# EAGLE board KMO_IO_MV2_5 (EAGLE 9.4.2)
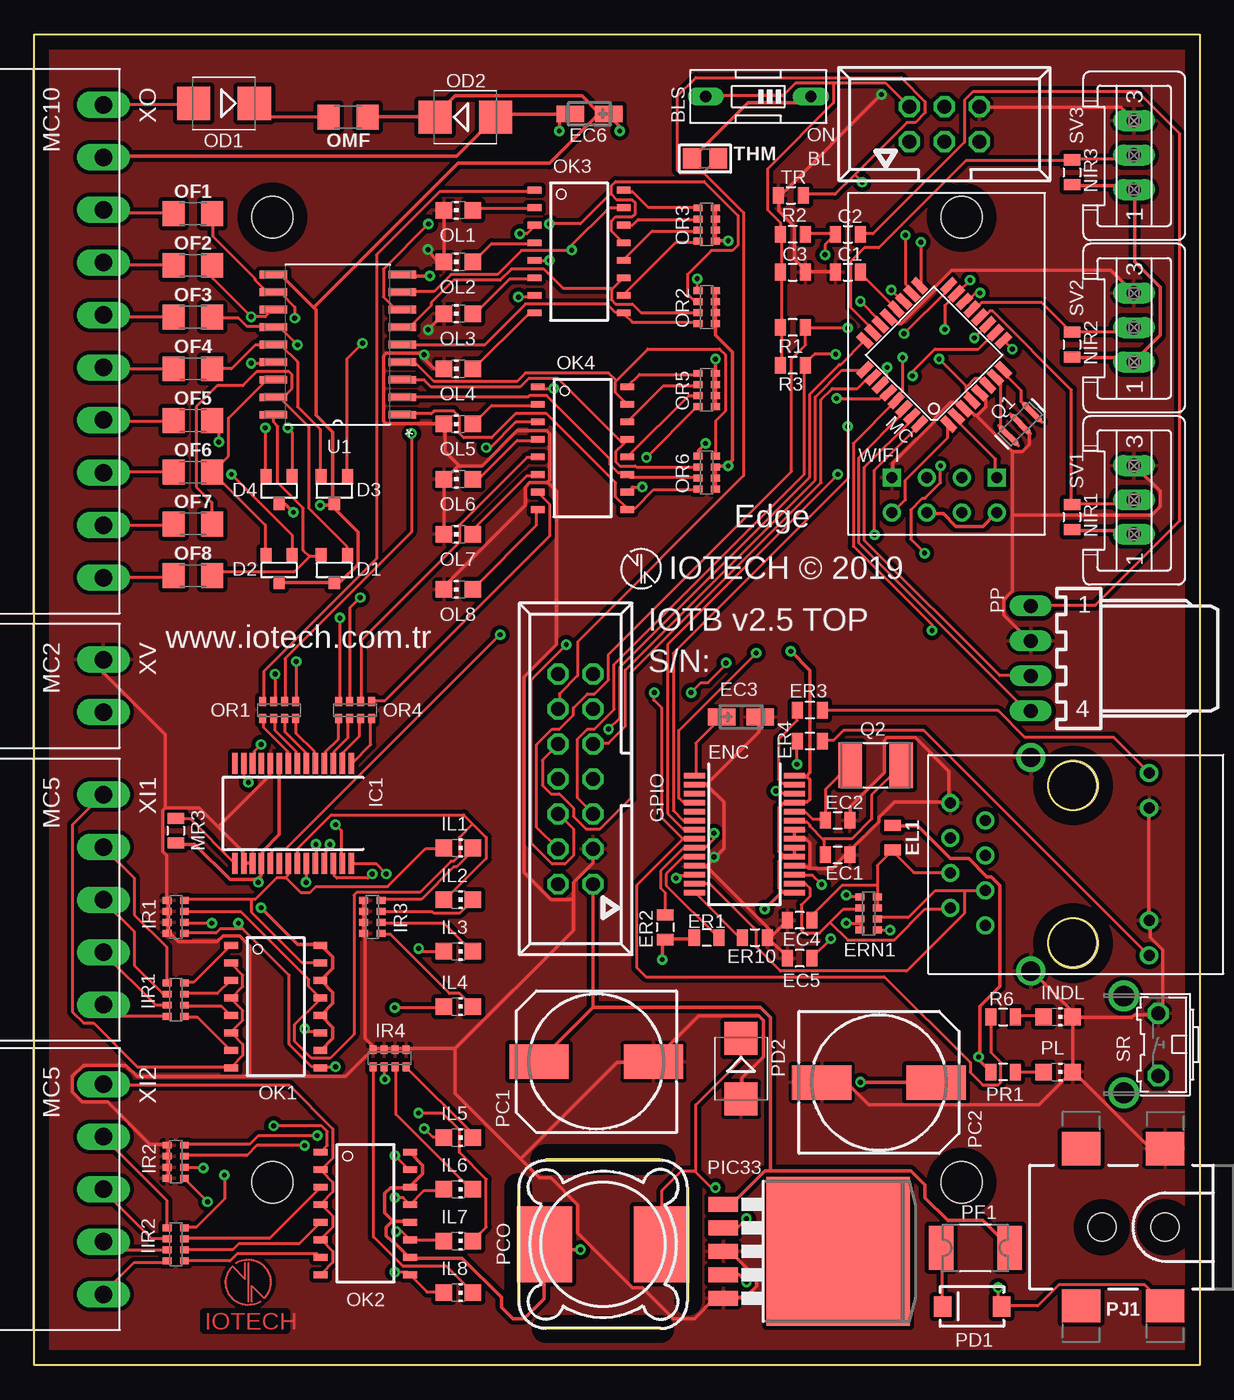
[diagram p2: board, top side]
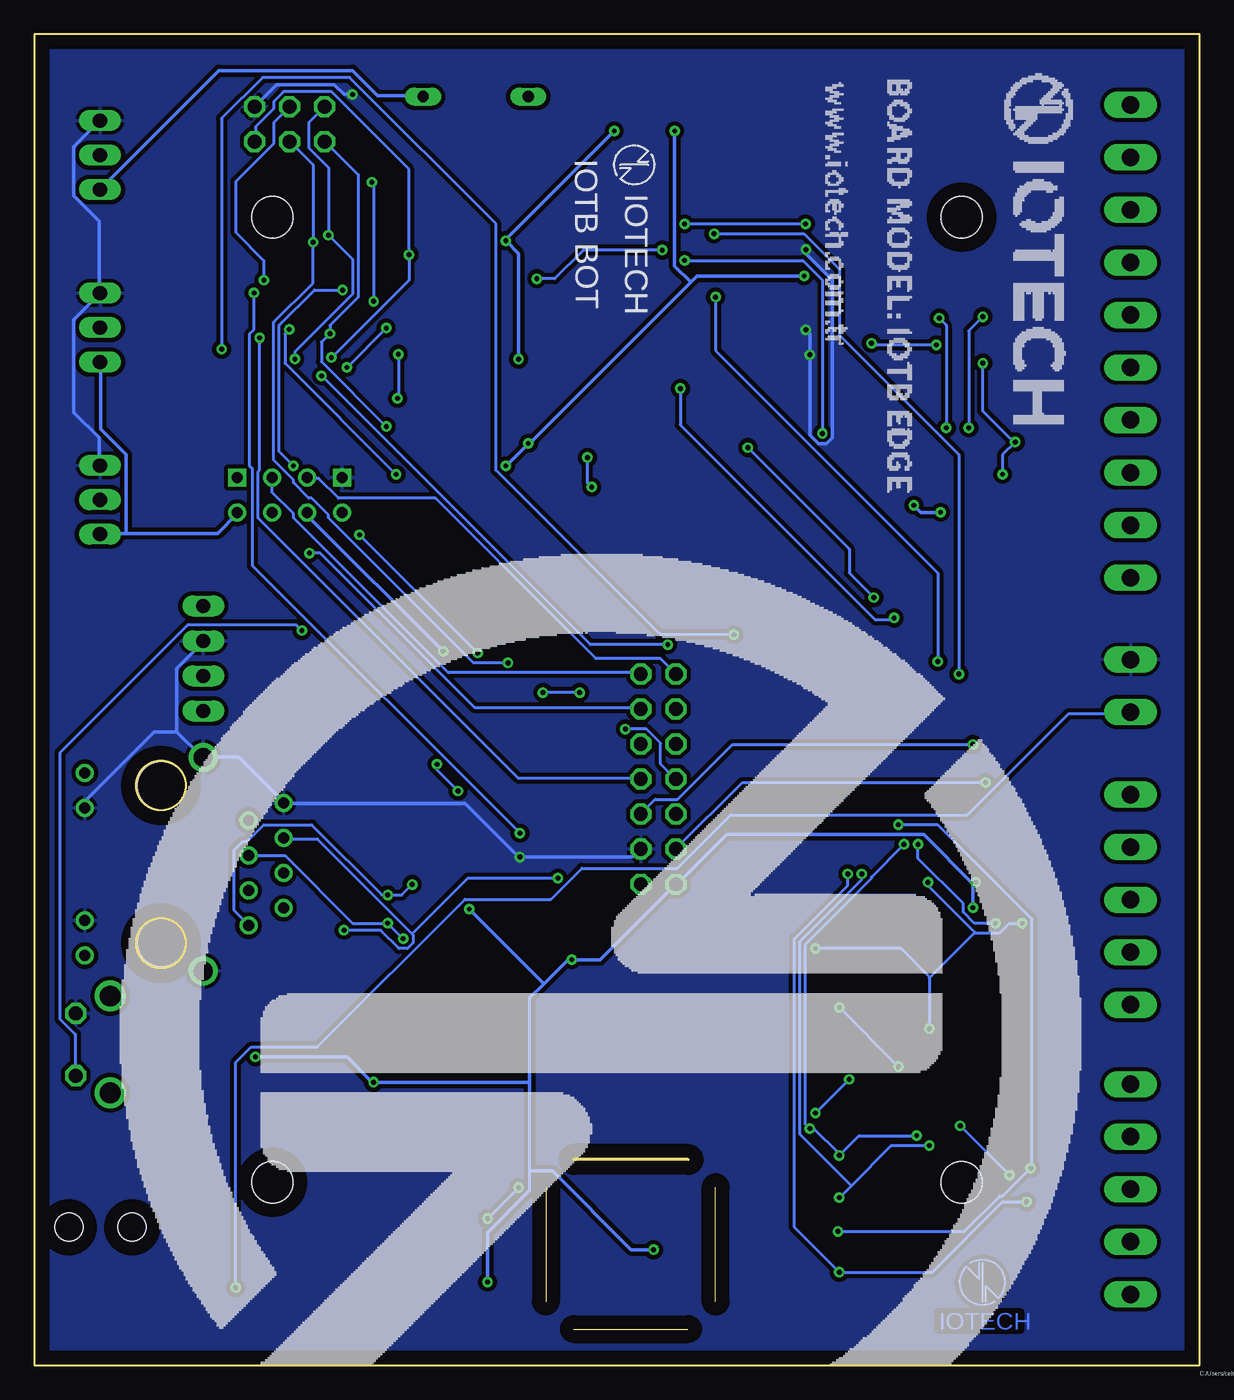
[diagram p3: board, bottom side, seen from below]

Size 84.5 x 96.5 mm. Coordinates in mm from the lower left corner, seen from the top.
Outline: 0,0 0,96.5 84.5,96.5 84.5,0 0,0
Copper layers (1*16): Top 0.035mm / dielectric 1.5mm / Bottom 0.035mm
Design rules "KMO_IO_M": minimum track width 6mil, minimum drill 0.35mm, track to track 0.205mm, track to pad 0.205mm, pad to pad 0.205mm, via to via 0.205mm, smd to smd 6mil, copper to edge 40mil, drill to drill 6mil, minimum pad ring 10mil, minimum via ring 8mil, stop-mask expansion 4mil, vias tented up to drill 0mil, thermal gap 10mil
Net classes: 0 default: width 0.203 mm, drill 0.3 mm, clearance 0.16 mm; 1 vcc: width 0.254 mm, drill 0.3 mm, clearance 0.16 mm; 2 3.3 power line: width 0.254 mm, drill 0.3 mm, clearance 0.16 mm; 3 outsise power line: width 0.254 mm, drill 0.3 mm, clearance 0.16 mm
Holes 3 mm at 17.25,83.25 67.25,83.25 17.25,13.25 67.25,13.25

## Footprints (pad centres in the part's own frame; a part is rotated, then mirrored left to right if it is on the bottom)
057-006-1 = drill 1 octagon: 1 -2.54,-1.27; 2 -2.54,1.27; 3 0,-1.27; 4 0,1.27; 5 2.54,-1.27; 6 2.54,1.27
EDG-01 = drill 0.813 long: 1 0,-3.81; 2 0,3.81
0805 = smd 0.8 x 1.2: 1 -0.9,0; 2 0.9,0
SOT-23-3 = smd 0.802 x 0.972: 1 -0.95,-1; 2 0.95,-1; 3 0,1
CT3216 = smd 2 x 1.2: + -1.4,0; - 1.4,0
SSOP28 = smd 0.4 x 1.5: 1 -4.225,-3.625; 2 -3.575,-3.625; 3 -2.925,-3.625; 4 -2.275,-3.625; 5 -1.625,-3.625; 6 -0.975,-3.625; 7 -0.325,-3.625; 8 0.325,-3.625; 9 0.975,-3.625; 10 1.625,-3.625; 11 2.275,-3.625; 12 2.925,-3.625; 13 3.575,-3.625; 14 4.225,-3.625; 15 4.225,3.625; 16 3.575,3.625; 17 2.925,3.625; 18 2.275,3.625; 19 1.625,3.625; 20 0.975,3.625; 21 0.325,3.625; 22 -0.325,3.625; 23 -0.975,3.625; 24 -1.625,3.625; 25 -2.275,3.625; 26 -2.925,3.625; 27 -3.575,3.625; 28 -4.225,3.625
0603-ARV = smd 0.5 x 0.65: 1 -1.2,-0.625; 2 -0.4,-0.625; 3 0.4,-0.625; 4 1.2,-0.625; 5 1.2,0.625; 6 0.4,0.625; 7 -0.4,0.625; 8 -1.2,0.625
057-014-1 = drill 1 octagon: 1 -7.62,-1.27; 2 -7.62,1.27; 3 -5.08,-1.27; 4 -5.08,1.27; 5 -2.54,-1.27; 6 -2.54,1.27; 7 0,-1.27; 8 0,1.27; 9 2.54,-1.27; 10 2.54,1.27; 11 5.08,-1.27; 12 5.08,1.27; 13 7.62,-1.27; 14 7.62,1.27
CHIP-LED0805 = smd 1.2 x 1.2: A 0,-1.05; C 0,1.05
TQFP32-08 = smd 1.27 x 0.559: 1 -4.293,2.8; 2 -4.293,2; 3 -4.293,1.2; 4 -4.293,0.4; 5 -4.293,-0.4; 6 -4.293,-1.2; 7 -4.293,-2; 8 -4.293,-2.8; 17 4.293,-2.8; 18 4.293,-2; 19 4.293,-1.2; 20 4.293,-0.4; 21 4.293,0.4; 22 4.293,1.2; 23 4.293,2; 24 4.293,2.8 | smd 0.559 x 1.27: 9 -2.8,-4.293; 10 -2,-4.293; 11 -1.2,-4.293; 12 -0.4,-4.293; 13 0.4,-4.293; 14 1.2,-4.293; 15 2,-4.293; 16 2.8,-4.293; 25 2.8,4.293; 26 2,4.293; 27 1.2,4.293; 28 0.4,4.293; 29 -0.4,4.293; 30 -1.2,4.293; 31 -2,4.293; 32 -2.8,4.293
SMB = smd 2.4 x 2.4: A 2.2,0; C -2.2,0
1206 = smd 1.6 x 1.8: 1 -1.4,0; 2 1.4,0
MINI-FLAT-16 = smd 1 x 0.5: 1 -3.24,4.445; 2 -3.24,3.175; 3 -3.24,1.905; 4 -3.24,0.635; 5 -3.24,-0.635; 6 -3.24,-1.905; 7 -3.24,-3.175; 8 -3.24,-4.445; 9 3.24,-4.445; 10 3.24,-3.175; 11 3.24,-1.905; 12 3.24,-0.635; 13 3.24,0.635; 14 3.24,1.905; 15 3.24,3.175; 16 3.24,4.445
140CLH-1010 = smd 4.3 x 2.5: + 4.15,0; - -4.15,0
MSS1260 = smd 5.5 x 4: P$1 0,4.25; P$2 0,-4.25
SMA-DIODE = smd 1.27 x 1.47: A -2.15,0; C 2.15,0
1820 = smd 1.78 x 3.2: 1 -2.49,0; 2 2.49,0
TO263-5 = smd 1.067 x 2.159: 1 -3.404,-5.791; 2 -1.702,-5.791; 3 0,-5.791; 4 1.702,-5.791; 5 3.404,-5.791 | smd 10.8 x 10.41: 6 0,2.54
POWER_JACK_SMD_OVERPASTE_TOE = smd 2.8 x 2.4: GND 0,-5.7; P$4 6.1,-5.7; VIN0 0,5.7; VIN1 6.1,5.7 | hole 2.032: 0,0; 4.572,0
7395-04 = drill 1.016 long: 1 3.81,0; 2 1.27,0; 3 -1.27,0; 4 -3.81,0
RESONATOR-SMD-1:1 = smd 0.45 x 1.905: 1 -1.2,0; 2 0,0; 3 1.2,0
5.0X3.2_2 = smd 1.7 x 3.3: 1 -1.85,0; 2 1.85,0
B3F-31XX = drill 1.016 octagon: 1 -2.261,-1.245; 2 2.261,-1.245 | drill 1.499 pad 2.159: 3 -3.505,1.245; 4 3.505,1.245
S03P = drill 1.016 long: 1 2.5,0; 2 0,0; 3 -2.5,0
MICROBUILDER_0805_NOTHERMALS = smd 1.3 x 1.5: 1 -0.95,0; 2 0.95,0
SOIC127P1030X265-18N = smd 1.981 x 0.559: 1 -4.674,5.08; 2 -4.674,3.81; 3 -4.674,2.54; 4 -4.674,1.27; 5 -4.674,0; 6 -4.674,-1.27; 7 -4.674,-2.54; 8 -4.674,-3.81; 9 -4.674,-5.08; 10 4.674,-5.08; 11 4.674,-3.81; 12 4.674,-2.54; 13 4.674,-1.27; 14 4.674,0; 15 4.674,1.27; 16 4.674,2.54; 17 4.674,3.81; 18 4.674,5.08
RJ45 = drill 0.8: G+ 5.84,-6.305; G- 5.84,-3.765; GND -8.57,4.76; NC -6.03,3.5; P4 -8.57,-0.32; P5 -6.03,0.96; RD+ -6.03,-1.58; RD- -8.57,2.22; TD+ -6.03,-4.12; TD- -8.57,-2.86; Y+ 5.84,6.945; Y- 5.84,4.405 | drill 1.4: SHIELD1 -2.73,-7.425; SHIELD2 -2.73,8.065 | hole 3.5: 0.3,-5.38; 0.3,6.02
ESP01 = drill 0.8: CH_PD -1.285,-8.178; GPIO0 1.255,-5.638; GPIO2 -1.285,-5.638; RST 1.255,-8.178; TX -3.825,-8.178; VCC 3.795,-8.178 | drill 0.8 square: GND -3.825,-5.638; RX 3.795,-5.638
MC5 = drill 1.27 long: 1 -7.62,0; 2 -3.81,0; 3 0,0; 4 3.81,0; 5 7.62,0
MC10 = drill 1.27 long: 1 -17.145,0; 2 -13.335,0; 3 -9.525,0; 4 -5.715,0; 5 -1.905,0; 6 1.905,0; 7 5.715,0; 8 9.525,0; 9 13.335,0; 10 17.145,0
MC2 = drill 1.27 long: 1 -1.905,0; 2 1.905,0

## Placement (x,y rotation side)
BL  057-006-1  [057-006-1]  66,90 0 top
BLS  ON  [EDG-01]  52.5,92 90 top
C1  100nF  [0805]  59,79.26 0 top
C2  100nF  [0805]  59,82.01 0 top
C3  100nF  [0805]  55,79.26 0 top
D1  BAV70  [SOT-23-3]  21.75,57.75 180 top
D2  BAV70  [SOT-23-3]  17.75,57.75 180 top
D3  BAV70  [SOT-23-3]  21.75,63.5 180 top
D4  BAV70  [SOT-23-3]  17.75,63.5 180 top
EC1  18p  [0805]  58.25,37 0 top
EC2  18p  [0805]  58.25,39.5 0 top
EC3  10u  [CT3216]  51.25,47 0 top
EC4  10n  [0805]  55.5,32.25 180 top
EC5  10n  [0805]  55.5,29.5 180 top
EC6  10u  [CT3216]  40.25,90.75 180 top
EL1  10µH  [0805]  62.25,38.25 270 top
ENC  ENC28J60-SSOP  [SSOP28]  51.5,38.5 270 top
ER1  10k  [0805]  48.75,31 180 top
ER2  10k  [0805]  45.75,31.75 270 top
ER3  1k  [0805]  56.25,47.5 180 top
ER4  1k  [0805]  56.25,45.25 180 top
ER10  2.7K  [0805]  52.25,31 0 top
ERN1  49.9R  [0603-ARV]  60.5,32.75 270 top
GPIO  057-014-1  [057-014-1]  39.25,42.5 90 top
IC1  MCP23017SS  [SSOP28]  18.75,40 180 top
IIR1  6.8K  [0603-ARV]  10.25,26.5 270 top
IIR2  6.8K  [0603-ARV]  10.25,8.75 270 top
IL1  BLU  [CHIP-LED0805]  30.75,37.5 270 top
IL2  BLU  [CHIP-LED0805]  30.75,33.75 270 top
IL3  BLU  [CHIP-LED0805]  30.75,30 270 top
IL4  BLU  [CHIP-LED0805]  30.75,26 270 top
IL5  BLU  [CHIP-LED0805]  30.75,16.5 270 top
IL6  BLU  [CHIP-LED0805]  30.75,12.75 270 top
IL7  BLU  [CHIP-LED0805]  30.75,9 270 top
IL8  BLU  [CHIP-LED0805]  30.75,5.25 270 top
INDL  BLU  [CHIP-LED0805]  74.25,25.25 270 top
IR1  10K  [0603-ARV]  10.25,32.5 90 top
IR2  10K  [0603-ARV]  10.25,14.75 90 top
IR3  1K  [0603-ARV]  24.5,32.5 270 top
IR4  1K  [0603-ARV]  25.75,22.25 180 top
MC  ATMEGA328  [TQFP32-08]  65.25,73.26 135 top
MR3  10K  [0805]  10.25,38.75 270 top
NIR1  4700  [0805]  75.25,61.5 270 top
NIR2  4700  [0805]  75.25,74 270 top
NIR3  4700  [0805]  75.25,86.5 270 top
OD1  SS54  [SMB]  13.75,91.5 180 top
OD2  28V  [SMB]  31.25,90.5 0 top
OF1  100mA  [1206]  11.5,83.5 0 top
OF2  100mA  [1206]  11.5,79.75 0 top
OF3  100mA  [1206]  11.5,76 0 top
OF4  100mA  [1206]  11.5,72.25 0 top
OF5  100mA  [1206]  11.5,68.5 0 top
OF6  100mA  [1206]  11.5,64.75 0 top
OF7  100mA  [1206]  11.5,61 0 top
OF8  100mA  [1206]  11.5,57.25 0 top
OK1  TLP283-4  [MINI-FLAT-16]  17.5,26 0 top
OK2  TLP283-4  [MINI-FLAT-16]  24,11 0 top
OK3  TLP283-4  [MINI-FLAT-16]  39.5,80.75 0 top
OK4  TLP283-4  [MINI-FLAT-16]  39.75,66.5 0 top
OL1  BLU  [CHIP-LED0805]  30.75,83.75 90 top
OL2  BLU  [CHIP-LED0805]  30.75,80 90 top
OL3  BLU  [CHIP-LED0805]  30.75,76.25 90 top
OL4  BLU  [CHIP-LED0805]  30.75,72.25 90 top
OL5  BLU  [CHIP-LED0805]  30.75,68.25 90 top
OL6  BLU  [CHIP-LED0805]  30.75,64.25 90 top
OL7  BLU  [CHIP-LED0805]  30.75,60.25 90 top
OL8  BLU  [CHIP-LED0805]  30.75,56.25 90 top
OMF  750mA  [1206]  22.75,90.5 180 top
OR1  1K  [0603-ARV]  17.75,47.5 180 top
OR2  10K  [0603-ARV]  48.75,76.72 270 top
OR3  10K  [0603-ARV]  48.75,82.72 270 top
OR4  1K  [0603-ARV]  23.25,47.5 180 top
OR5  10K  [0603-ARV]  48.75,70.72 270 top
OR6  10K  [0603-ARV]  48.75,64.72 270 top
PC1  220uf 50v  [140CLH-1010]  40.75,22 180 top
PC2  220uf 50v  [140CLH-1010]  61.25,20.5 0 top
PCO  220 uh  [MSS1260]  41.25,8.75 90 top
PD1  M7  [SMA-DIODE]  68,4.25 180 top
PD2  SS54  [SMB]  51.25,21.5 270 top
PF1  1A  [1820]  68.25,8.5 0 top
PIC33  LM2596S-3.3  [TO263-5]  55.75,8.25 270 top
PJ1  POWER_JACKTOE  [POWER_JACK_SMD_OVERPASTE_TOE]  82,10 180 top
PL  GRN  [CHIP-LED0805]  74.25,21.25 270 top
PP  22-05-7048-04  [7395-04]  72.25,51.25 90 top
PR1  1k  [0805]  70.25,21.25 180 top
Q1  8MHz  [RESONATOR-SMD-1:1]  71.5,68.26 45 top
Q2  25MHz  [5.0X3.2_2]  61,43.5 0 top
R1  1.5K  [0805]  55,75.25 180 top
R2  10K  [0805]  55,82.01 180 top
R3  1.5K  [0805]  55,72.5 180 top
R6  1k  [0805]  70.25,25.25 0 top
SR  gnd  [B3F-31XX]  80.25,23.25 90 top
SV1  3.3V  [S03P]  79.75,62.75 270 top
SV2  3.3V  [S03P]  79.75,75.25 270 top
SV3  3.3V  [S03P]  79.75,87.75 270 top
THM  THERM  [MICROBUILDER_0805_NOTHERMALS]  48.64,87.5 0 top
TR  10K  [0805]  54.86,84.84 0 top
U1  ULN2803ADW  [SOIC127P1030X265-18N]  22,74 180 top
U$1  [IOTECH_COPPER_W_TEXT]  15.5,6 0 top
U$2  HR911105A  [RJ45]  75,36 0 top
U$4  [IOTECH_COPPER_W_TEXT]  15.75,6 0 bottom
WIFI  ESP01  [ESP01]  66,70 0 top
XI1  MC5  [MC5]  5,33.75 270 top
XI2  MC5  [MC5]  5,12.75 270 top
XO  MC10  [MC10]  5,74.25 270 top
XV  MC2  [MC2]  5,49.25 270 top

## Tracks (layer width: path | path; a pad name or v marks a point on that pad's centre or on a via)
+3V3  (via drill 0.35)
  Top 0.254: THM.1 47.76,87.56 51.74,91.54 55.82,91.54 56.23,91.95 BLS.1 | NIR3.2 75.31,85.52 79.5,85.52 79.7,85.31 SV3.1 79.8,85.21 79.8,80.01 81.64,78.17 81.64,74.7 79.8,72.86 SV2.1 79.7,72.76 79.39,73.07 75.31,73.07 NIR2.2 | NIR1.2 75.31,60.52 79.5,60.52 79.7,60.31 SV1.1 | WIFI.CH_PD 64.8,61.74 65.92,61.74 66.84,60.82 68.78,60.82 69.7,61.74 WIFI.VCC | OK1.10 20.82,22.86 21.64,23.68 21.64,24.49 20.82,25.31 OK1.12 20.82,25.41 21.64,26.23 21.64,27.04 20.82,27.86 OK1.14 20.82,27.96 21.64,28.78 21.64,29.59 20.82,30.41 OK1.16 20.72,30.51 19.08,30.51 v16.43,33.17 | 16.12,35.21 14.19,35.21 11.63,37.76 10.31,37.76 MR3.2 | 16.12,35.21 16.43,35.51 16.43,36.33 IC1.18 16.53,36.43 16.53,37.25 17.76,38.47 17.76,43.58 IC1.9 | v16.23,35 16.12,35.1 16.12,35.21 | OK2.16 27.25,15.41 28.17,14.49 28.17,13.88 27.25,12.96 OK2.14 27.14,12.86 25.82,12.86 25.41,12.45 25.41,11.02 25.92,10.51 25.92,10.41 | 25.92,10.41 25.51,10 25.51,9.39 25.92,8.98 26.02,8.98 27.14,7.86 OK2.10 27.35,7.76 31.02,7.76 33.88,4.9 33.88,4.18 34.7,3.37 35.51,3.37 36.94,4.8 36.94,8.67 PCO.P$1 37.04,8.37 v39.59,8.37 | 25.92,10.41 27.14,10.41 OK2.12 | 68.58,22.35 68.58,22.04 69.29,21.33 PR1.2 | 68.58,22.35 68.58,26.02 70.01,27.45 70.01,34.8 69.39,35.41 69.09,35.41 67.76,36.74 66.44,36.74 64.09,39.09 62.25,39.09 EL1.1 | 54.29,34.29 55.11,34.29 ENC.15 | 54.29,34.29 53.98,34.59 53.98,36.53 54.29,36.84 | 54.29,36.84 55.11,36.84 ENC.19 55.11,36.94 55.11,37.45 ENC.20 | 54.29,36.84 54.29,36.94 53.98,37.25 53.98,40.41 54.29,40.72 55.11,40.72 ENC.25 55.21,40.82 56.02,40.82 56.23,41.02 56.23,42.45 56.02,42.66 55.21,42.66 ENC.28 56.01,42.73 56.26,42.97 56.26,50.37 v54.86,51.77
  Top 0.254: ER1.2 47.76,30.92 45.82,30.92 ER2.2 45.53,30.64 v45.53,29.4 | v51.64,6.02 51.13,6.53 50.01,6.53 PIC33.4 | v59.9,20.51 65.31,20.51 PC2.+ | v52.96,33.06 54.19,34.29 54.29,34.29 | v68.48,22.35 68.58,22.35
  Bottom 0.254: 77.86,60.31 71.23,60.31 69.8,61.74 WIFI.VCC | 77.86,60.31 79.7,60.31 SV1.1 | 77.86,60.31 77.86,66.03 79.7,67.86 79.7,72.66 SV2.1 | BLS.1 56.33,92.05 59.6,92.05 61.43,93.89 71.13,93.89 79.7,85.31 SV3.1 | v16.43,33.17 16.43,34.8 v16.23,35 16.43,34.9 20,38.47 34.29,38.47 37.86,34.9 GPIO.2 38.06,34.8 43.47,29.4 v45.53,29.4 45.81,29.4 47.55,27.66 | v51.64,6.02 51.64,9.59 48.58,12.65 48.58,14.08 | 48.58,20.51 48.58,26.64 47.55,27.66 | 48.58,20.51 48.58,14.08 | 48.58,20.51 v59.9,20.51 60.01,20.51 61.84,22.35 v68.48,22.35 | 47.55,27.66 v52.96,33.06 | v39.59,8.37 41.23,8.37 46.94,14.08 48.58,14.08 | v54.86,51.77 64.67,61.58 WIFI.CH_PD
A0
  Top 0.203: SV3.2 79.7,87.66 79.5,87.46 75.31,87.46 NIR3.1 75.21,87.36 67.56,87.36 61.23,81.03 60.21,81.03 59.19,80.01 59.19,76.74 60.72,75.21 60.72,74.91 MC.23
A1  (via drill 0.35)
  Top 0.203: v41.64,46.13 42.45,46.94 42.45,50.62 56.23,64.39 56.23,70.42 58.37,72.56 58.48,72.56 60.21,74.29 MC.24
  Bottom 0.203: v41.64,46.13 40.11,46.13 39.09,45.11 39.09,43.58 38.06,42.55 GPIO.8
A2
  Top 0.203: MC.25 60.21,72.15 58.58,72.15 56.64,70.21 56.64,64.19 42.86,50.41 42.86,46.33 41.64,45.11 40.62,45.11 GPIO.9
A3
  Top 0.203: MC.26 60.72,71.54 60.41,71.54 59.7,70.82 57.86,70.82 57.05,70.01 57.05,63.98 43.27,50.21 43.27,41.13 41.02,38.88 40,38.88 39.09,39.8 39.09,40.41 38.06,41.43 37.45,41.43 36.84,42.05 36.84,43.88 37.96,45 GPIO.10
A4  (via drill 0.35)
  Top 0.203: v58.98,75.21 55.92,75.21 R1.1 55.92,75.11 55.92,73.99 54.9,72.97 54.9,64.8 41.64,51.53 41.64,49.7 40.62,48.68 40.11,48.68 39.09,47.66 39.09,47.15 38.06,46.13 37.55,46.13 36.43,45 36.43,38.98 37.96,37.45 GPIO.4 | v61.84,72.35 61.84,71.54 61.43,71.13 MC.27 | v15.51,42.25 15.21,42.55 15.21,43.58 IC1.13
  Bottom 0.203: v61.84,72.35 v58.98,75.21 | v15.51,42.25 33.17,42.25 37.96,37.45 GPIO.4
A5  (via drill 0.35)
  Top 0.203: v58.11,73.31 56.58,73.31 55.82,72.55 55.82,72.42 | 55.82,72.42 55.82,64.6 42.05,50.82 42.05,47.55 40.62,46.13 40.11,46.13 39.39,45.41 39.39,41.13 40.51,40 GPIO.5 | R3.1 55.82,72.42 | v58.17,70.11 61.33,70.11 61.64,70.42 61.84,70.42 MC.28 | v16.43,45 15.92,44.49 15.92,43.68 IC1.12
  Bottom 0.203: v58.17,70.11 58.11,70.11 v58.11,73.31 | v16.43,45 33.88,45 37.86,41.02 39.49,41.02 40.51,40 GPIO.5
A6  (via drill 0.35)
  Top 0.203: v62.15,77.97 62.97,77.15 MC.19 | v65.72,65.21 65.72,63.98 64.6,62.86 64.39,62.86 63.55,62.02 63.55,59.89 v64.57,58.88
  Bottom 0.203: v62.15,77.97 64.19,77.97 66.74,75.42 66.74,66.23 v65.72,65.21 | v64.57,58.88 63.78,58.88 52.56,47.66 40.62,47.66 GPIO.11
A7  (via drill 0.35)
  Top 0.203: 59.49,86.33 63.27,90.11 63.88,90.11 64.6,90.83 64.6,91.64 62.86,93.38 47.96,93.38 46.64,92.05 46.64,86.64 46.84,86.44 48.47,86.44 48.52,86.49 | 59.49,86.33 58.07,84.91 55.82,84.91 TR.2 | 48.52,86.49 49.49,87.46 THM.2 | v59.9,77.15 61.33,75.72 61.33,75.52 MC.22 | 59.49,86.33 v60.03,85.79 | 48.52,86.49 51.43,83.58 51.43,64.5 39.39,52.45 39.39,50.01 38.06,48.68 38.06,47.66 GPIO.12
  Bottom 0.203: v60.03,85.79 59.9,85.66 v59.9,77.15
AREF
  Top 0.203: C1.2 59.9,79.19 62.45,76.64 MC.20
BLV  (via drill 0.35)
  Top 0.203: R3.2 54.19,72.56 54.19,75.21 R1.2 54.19,75.31 54.19,79.19 C3.1 54.19,79.29 54.19,81.95 R2.2 54.09,82.05 54.09,82.86 53.17,83.78 53.17,86.74 57.96,91.54 57.96,92.97 | 67.61,70.98 68.17,71.54 68.68,71.54 69.09,71.13 MC.6 | 67.61,70.98 67.56,70.92 67.56,70.62 67.97,70.21 67.97,70.01 MC.4 | v63.17,81.95 63.17,78.37 63.58,77.97 63.58,77.76 MC.18 | v65.62,72.97 67.61,70.98 | 57.96,92.97 61.74,92.97 63.37,91.33 BL.2 | 57.96,92.97 55.21,92.97 54.29,92.05 48.78,92.05 BLS.2
  Bottom 0.203: BL.2 63.48,91.23 64.6,90.11 64.6,88.27 63.17,86.84 v63.17,81.95 61.43,80.21 61.43,77.66 65.62,73.48 v65.62,72.97
COM1
  Top 0.203: OK1.2 14.29,29.08 15.1,28.27 15.1,27.45 14.29,26.64 OK1.4 14.29,26.53 15.1,25.72 15.1,25 14.29,24.19 OK1.6 14.29,24.08 15.1,23.27 15.1,22.45 14.29,21.64 OK1.8 14.19,21.64 7.45,21.64 4.29,24.8 3.57,24.8 2.75,25.61 2.75,39.19 4.9,41.33 XI1.1
COM2
  Top 0.203: OK2.8 20.82,6.63 21.64,7.45 21.64,8.27 20.82,9.08 OK2.6 20.82,9.18 21.64,10 21.64,10.82 20.82,11.63 OK2.4 20.82,11.74 21.64,12.55 21.64,13.27 20.82,14.08 OK2.2 20.82,14.19 21.64,15 21.64,17.14 18.47,20.31 5,20.31 XI2.1
D2  (via drill 0.35)
  Top 0.203: v60.92,60.21 60.92,64.9 64.19,68.17 MC.32 | v52.35,51.64 46.74,46.02 46.74,41.13 47.05,40.82 47.86,40.82 ENC.4
  Bottom 0.203: v52.35,51.64 v60.92,60.21
D3
  Top 0.203: MC.1 66.23,68.17 66.23,67.25 63.17,64.19 63.17,62.76 62.25,61.84 WIFI.TX
D4
  Top 0.203: MC.2 66.94,68.78 66.94,68.48 69.7,65.72 69.7,64.39 WIFI.RX
D5  (via drill 0.35)
  Top 0.203: v70.92,73.68 70.31,74.29 MC.9 | v33.78,52.96 18.27,37.45 17.45,37.45 17.14,37.15 17.14,36.43 IC1.19
  Bottom 0.203: v70.92,73.68 70.92,90.42 67.97,93.38 61.64,93.38 51.02,82.76 51.02,64.9 39.09,52.96 v33.78,52.96
D6  (via drill 0.35)
  Top 0.203: v63.68,71.74 63.68,72.05 65.31,73.68 68.48,73.68 69.6,74.8 MC.10 | v38.58,52.25 36.02,49.7 36.02,37.86 37.55,36.33 38.47,36.33 39.09,36.94 39.09,38.88 38.06,39.9 GPIO.6
  Bottom 0.203: v63.68,71.74 44.19,52.25 v38.58,52.25
D7  (via drill 0.35)
  Top 0.203: v68.17,74.5 69.09,75.42 MC.11
  Bottom 0.203: v68.17,74.5 68.17,64.9 68.27,64.8 68.27,61.43 49.39,42.55 40.62,42.55 GPIO.7
D8
  Top 0.203: SV1.2 79.7,62.66 79.5,62.45 75.31,62.45 NIR1.1 75.21,62.45 75.21,70.72 69.5,76.44 69.29,76.44 68.88,76.03 68.58,76.03 MC.12
D9
  Top 0.203: SV2.2 79.7,75.21 79.39,74.91 75.31,74.91 NIR2.1 75.21,74.91 73.07,77.05 68.68,77.05 68.27,76.64 68.07,76.64 MC.13
D10  (via drill 0.35)
  Top 0.203: ER2.1 45.72,32.66 45.72,34.29 45.41,34.59 45.41,35.82 47.05,37.45 47.86,37.45 ENC.9 47.96,37.55 48.68,37.55 49.29,38.17 v49.29,38.58 | v68.58,77.76 68.27,77.76 67.66,77.15 67.45,77.15 MC.14
  Bottom 0.203: v68.58,77.76 68.58,75.11 68.88,74.8 68.88,65.21 68.68,65.01 68.68,57.96 v49.29,38.58
D11  (via drill 0.35)
  Top 0.203: v67.86,78.68 66.94,77.76 MC.15 66.84,77.66 66.03,76.84 v66.03,75.11 | v58.27,64.6 45.92,52.25 45.92,40 47.05,38.88 47.86,38.88 ENC.7
  Bottom 0.203: v67.86,78.68 67.86,80.11 69.9,82.15 69.9,85.82 67.15,88.58 67.15,90.11 66.03,91.23 BL.4 | v58.27,64.6 66.33,72.66 66.33,74.8 v66.03,75.11
D12  (via drill 0.35)
  Top 0.203: v63.07,74.8 66.23,77.97 66.23,78.27 MC.16 | v58.98,68.07 58.98,64.29 46.33,51.64 46.33,40.21 47.05,39.49 47.86,39.49 ENC.6
  Bottom 0.203: BL.1 63.37,88.68 61.03,86.33 61.03,77.46 63.07,75.42 v63.07,74.8 63.68,74.19 63.68,72.76 v58.98,68.07
D13  (via drill 0.35)
  Top 0.203: v64.29,81.44 64.29,78.37 MC.17 | R6.1 69.39,25.21 69.39,22.66 70.11,21.94 70.11,20.51 69.9,20.31 68.78,20.31 67.86,21.23 67.86,21.94 61.64,28.17 44.35,28.17 43.68,28.84 43.68,34.8 47.05,38.17 47.86,38.17 ENC.8 46.99,38.17 45.46,39.7 45.46,47.7 44.93,48.23 44.93,48.77 v44.96,48.77 | v50.16,50.92 50.16,50.8 48.86,49.5 48.35,49.5 v47.62,48.77
  Bottom 0.203: BL.3 65.92,88.68 64.29,87.05 v64.29,81.44 64.29,78.48 67.15,75.62 67.15,65.62 65.72,64.19 65.72,63.98 64.6,62.86 64.39,62.86 63.17,61.64 63.17,61.43 52.66,50.92 v50.16,50.92 | v44.96,48.77 v47.62,48.77
DTR
  Top 0.203: C2.2 59.9,82.05 60.82,82.05 67.45,88.68 67.45,91.74 68.07,92.36 80.01,92.36 83.07,89.29 83.07,61.23 76.95,55.11 72.25,55.11 PP.1
EP4
  Top 0.203: ERN1.7 61.13,33.17 61.13,33.88 ERN1.8 61.13,33.98 61.13,34.8 | 61.13,34.8 61.13,36.23 62.15,37.25 EL1.2 62.25,37.25 63.78,35.72 66.33,35.72 U$2.P4 | 61.13,34.8 58.58,34.8 56.43,32.66 56.43,32.35 EC4.1
EP5  (via drill 0.35)
  Top 0.203: 59.9,32.04 59.9,32.35 ERN1.3 | 59.9,32.04 59.9,31.64 ERN1.4 | v58.88,32.04 59.9,32.04 | v57.76,30.92 56.43,29.59 EC5.1
  Bottom 0.203: U$2.P5 68.88,36.94 66.33,36.94 61.43,32.04 v58.88,32.04 v57.76,30.92
GND  (via drill 0.35)
  Top 0.254: MC.21 61.94,75.92 62.25,75.92 62.66,75.52 62.86,75.52 65.31,77.97 65.31,78.17 66.54,79.39 78.07,79.39 79.7,77.76 SV2.3 | C1.1 58.07,79.29 55.92,79.29 C3.2 55.92,79.39 55.11,80.21 55.11,82.56 53.98,83.68 53.98,84.8 TR.1 54.09,84.8 v61.43,92.15 | BL.6 68.58,91.23 78.78,91.23 79.7,90.31 SV3.3 | 68.37,68.88 68.17,68.88 67.76,69.29 67.45,69.29 MC.3 67.35,69.39 66.94,69.8 66.44,69.8 65.31,68.68 65.31,68.48 62.25,65.41 62.25,64.39 WIFI.GND | 68.37,68.88 68.99,69.5 68.99,70.01 68.58,70.42 MC.5 | 70.92,66.23 71.64,66.23 72.15,66.74 72.15,67.45 Q1.2 | 70.92,66.23 68.37,68.78 68.37,68.88 | ENC.22 55.11,38.78 55.11,38.27 ENC.21 55.21,38.17 55.92,38.17 56.23,37.86 56.23,36.02 | 56.23,36.02 56.13,36.02 56.02,36.13 55.21,36.13 ENC.18 | 56.23,36.02 57.86,36.02 58.78,36.94 59.09,36.94 EC1.2 59.19,37.04 59.19,37.35 61.23,39.39 61.23,39.7 62.35,40.82 66.23,40.82 U$2.GND 66.33,40.82 66.33,43.06 63.88,45.51 61.84,45.51 61.64,45.31 61.64,42.96 59.19,40.51 59.19,39.59 EC2.2 | 70.92,61.64 70.92,56.13 70.31,55.52 70.31,54.39 72.15,52.56 PP.2 | 70.92,61.64 70.92,66.23 | U$2.Y- 80.82,40.31 80.82,32.35 U$2.G- 80.93,32.15 80.93,31.02 81.84,30.11 81.84,25.82 81.54,25.51 SR.2 81.44,25.41 79.8,25.41 79.6,25.21 75.42,25.21 INDL.C | PL.C 75.31,21.33 75.31,25.21 INDL.C | INDL.C 75.21,25.31 75.21,25.72 72.35,28.57 U$2.SHIELD1 | PJ1.GND 81.95,15.72 80.93,15.72 75.42,21.23 PL.C | PC2.- 57.15,20.41 58.98,20.41 60.52,18.88 72.86,18.88 75.21,21.23 PL.C | 70.92,61.64 81.03,61.64 81.64,62.25 81.64,63.37 79.8,65.21 SV1.3 | OL1.C 29.7,83.68 OL2.C 29.2,80.03 v28.55,80.9 | 37.15,63.98 35.92,63.98 35.62,63.68 35.62,62.35 29.8,56.54 29.8,56.33 OL8.C
  Top 0.254: 37.15,63.98 37.35,64.19 37.35,67.56 37.15,67.76 35,67.76 32.45,65.21 30.72,65.21 | 30.72,65.21 29.8,64.29 OL6.C 29.7,64.19 29.7,60.31 OL7.C | 30.72,65.21 30.72,65.31 29.8,66.23 29.8,68.17 OL5.C 29.59,68.27 25.51,68.27 25.31,68.48 25.31,73.17 25.51,73.37 27.86,73.37 28.11,73.12 | 28.11,73.12 28.98,72.25 OL4.C | OL3.C 28.55,75.1 v28.55,75.08 | 28.11,73.12 v28.27,73.27 | 9.49,40.41 9.29,40.21 9.29,37.25 9.59,36.94 9.59,33.78 IR1.5 9.7,33.68 9.7,32.96 IR1.6 9.7,32.86 9.7,32.15 IR1.7 9.7,32.04 9.7,31.33 IR1.8 9.8,31.33 10.41,30.72 13.27,30.72 13.68,31.12 14.9,31.12 15.61,30.41 15.61,20.92 | 9.49,40.41 11.94,40.41 13.32,39.03 | 13.32,39.03 15.1,37.25 15.1,36.43 IC1.16 15.21,36.43 15.82,36.43 IC1.17 | 13.32,39.03 17.04,42.76 17.04,43.58 IC1.10 | 9.49,40.41 9.49,45.72 5,50.21 5,51.13 XV.1 | 48.78,42.15 47.96,42.15 ENC.2 | 48.78,42.15 52.56,45.92 52.56,46.94 EC3.- | 53.63,31.28 EC4.2 | 53.63,31.28 53.37,31.02 53.17,31.02 ER10.2 53.27,30.92 54.6,29.59 EC5.2 | 48.78,36.13 47.96,36.13 ENC.11 | 53.63,31.28 48.78,36.13 | 49.34,36.79 48.78,36.23 48.78,36.13 | 49.34,36.79 50.01,37.45 50.01,40.82 48.78,42.05 48.78,42.15 | PD2.A 51.33,19.39 51.33,20.82 52.86,22.35 52.86,25 52.56,25.31 48.17,25.31 44.9,22.04 PC1.- 44.8,21.94 42.25,21.94 35.26,14.95 | PIC33.3 50.01,8.16 50.52,8.16 52.35,6.33 52.35,5.71 51.53,4.9 50.01,4.9 PIC33.5 49.9,4.8 49.29,4.8 47.86,3.37 46.33,3.37 44.09,5.61 43.37,5.61 39.39,9.59 39.39,11.63 37.45,13.57 36.64,13.57 35.26,14.95 | IR3.1 23.88,33.68 23.88,32.96 IR3.2 23.88,32.86 23.88,32.15 IR3.3 23.88,32.04 23.88,31.33 IR3.4 23.98,31.23 23.98,23.68 24.59,23.06 IR4.4
  Top 0.254: IR2.8 9.7,13.57 9.7,14.29 IR2.7 9.7,14.39 9.7,15.1 IR2.6 9.7,15.21 9.7,15.92 IR2.5 9.59,16.02 8.37,16.02 5.31,19.08 3.47,19.08 2.75,19.8 2.75,20.92 3.57,21.74 6.63,21.74 7.45,20.92 15.61,20.92 | IR4.4 24.59,22.96 25.31,22.96 IR4.3 25.41,22.96 26.12,22.96 IR4.2 26.23,22.96 26.94,22.96 IR4.1 27.04,22.96 30.51,22.96 | 15.61,20.92 22.55,20.92 24.49,22.86 IR4.4 | 39.09,33.78 39.09,31.53 30.51,22.96 | 39.09,33.78 39.09,35 40.51,36.43 40.51,37.35 GPIO.3 | 35.26,14.95 30.51,19.7 30.51,22.96 | v49.29,36.84 49.34,36.79 | 39.09,33.78 37.45,33.78 35.51,35.72 35.51,49.9 37.86,52.25 37.86,63.37 37.25,63.98 37.15,63.98
  Bottom 0.254: SV1.3 79.8,65.31 79.8,67.25 81.64,69.09 81.64,75.82 79.8,77.66 SV2.3 79.8,77.86 79.8,82.97 81.64,84.8 81.64,88.38 79.8,90.21 SV3.3 | v61.43,92.15 62.05,92.15 62.76,92.86 66.94,92.86 68.48,91.33 BL.6 | 74.19,45.92 74.19,50.52 72.25,52.45 PP.2 | 74.19,45.92 72.35,44.09 U$2.SHIELD2 72.15,44.09 69.7,44.09 66.44,40.82 U$2.GND 66.33,40.72 53.27,40.72 49.39,36.84 v49.29,36.84 41.13,36.84 40.62,37.35 GPIO.3 | 74.19,45.92 75.82,45.92 80.82,40.92 80.82,40.41 U$2.Y- | v28.55,75.08 28.27,74.8 v28.27,73.27 28.27,67.45 27.66,66.84 27.04,66.84 26.64,67.25 26.64,78.68 28.55,80.59 v28.55,80.9
  pour Top (isolate 0.305): -6.86,101.6 89.15,101.6 92.46,98.3 92.46,-1.91 87.25,-7.11 -0.25,-7.11 -7.62,0.25 -7.62,0.51 -7.62,100.84
  pour Bottom (isolate 0.305): -8.76,104.39 96.77,104.39 97.16,104.78 97.16,-9.65 93.73,-13.08 -2.41,-13.08 -16.26,0.76 -16.26,96.9
GNDO  (via drill 0.35)
  Top 0.254: OR2.8 49.39,77.86 49.39,77.15 OR2.7 49.39,77.05 49.39,76.44 OR2.6 49.39,76.23 49.39,75.62 OR2.5 49.39,75.42 49.39,74.7 50.62,73.48 50.62,65.62 50.31,65.31 v50.31,65.21 49.39,65.21 OR6.7 49.39,65.11 49.39,64.39 OR6.6 49.39,64.29 49.39,63.58 OR6.5 | v48.68,66.84 48.17,66.33 48.17,65.92 OR6.1 | v28.68,78.99 26.74,78.99 U1.9 | XO.2 5,87.66 30.61,87.66 33.37,90.42 OD2.A 33.47,90.52 33.68,90.72 38.78,90.72 EC6.- 38.06,90.62 v38.06,89.5
  Bottom 0.254: v50.31,65.21 v48.68,66.84 48.58,66.84 36.89,78.53 | v28.68,78.99 36.43,78.99 36.89,78.53 | 36.89,78.53 38.06,79.7 v38.06,89.5
GPA0
  Top 0.203: 15.72,33.78 16.02,33.78 17.55,35.31 18.16,35.31 18.22,35.36 | 15.72,33.78 10.92,33.78 IR1.4 | 18.22,35.36 18.37,35.51 18.37,36.33 IC1.21 | 15.72,33.78 15.72,32.86 19.39,29.19 20.72,29.19 OK1.15 | 18.22,35.36 19.29,34.29 20,34.29 20.41,34.7 25.61,34.7 28.37,37.45 29.7,37.45 IL1.A
GPA1
  Top 0.203: IR1.3 10.92,32.86 15,32.86 19.9,27.96 19.9,27.45 20.72,26.64 OK1.13 20.72,26.53 18.88,24.7 18.88,23.47 20.1,22.25 21.43,22.25 23.16,23.98 23.16,34.09 23.37,34.29 27.96,34.29 30.21,36.53 30.41,36.53 30.82,36.94 30.82,38.27 31.79,39.24 | 31.79,39.24 31.12,39.9 21.53,39.9 19.08,37.45 19.08,36.43 IC1.22 | 31.79,39.24 32.76,38.27 32.76,36.74 29.8,33.78 IL2.A
GPA2  (via drill 0.35)
  Top 0.203: v12.86,32.04 10.92,32.04 IR1.2 | v19.7,35 19.7,36.33 IC1.23 | v19.59,24.39 19.8,24.19 20.72,24.19 OK1.11 | v27.86,30.21 28.06,30 IL3.A
  Bottom 0.203: v12.86,32.04 13.78,32.04 14.49,31.33 16.23,31.33 16.28,31.38 | 16.28,31.38 19.7,34.8 v19.7,35 | v19.59,24.39 19.59,28.06 19.54,28.11 | 16.28,31.38 19.54,28.11 | v27.86,30.21 21.64,30.21 19.54,28.11
GPA3  (via drill 0.35)
  Top 0.203: 14.8,31.64 15.1,31.64 18.47,28.27 18.47,23.27 20.1,21.64 20.72,21.64 OK1.9 20.82,21.64 v21.84,21.64 | 14.8,31.64 13.47,31.64 13.16,31.33 10.92,31.33 IR1.1 | v26.12,25.92 29.7,25.92 IL4.A | v20.41,37.76 20.41,36.43 IC1.24 | 14.8,31.64 v14.8,32.04
  Bottom 0.203: v21.84,21.64 v26.12,25.92 | v20.41,37.76 20.41,36.74 17.14,33.47 17.14,32.86 16.33,32.04 v14.8,32.04
GPA4  (via drill 0.35)
  Top 0.203: v20.51,16.63 16.23,16.63 15.61,16.02 10.92,16.02 IR2.4 | v26.12,15.21 27.14,14.19 OK2.15 | v28.27,17.14 28.88,16.53 29.7,16.53 IL5.A | v21.43,37.76 21.12,37.45 21.12,36.43 IC1.25
  Bottom 0.203: v20.51,16.63 24.7,16.63 v26.12,15.21 26.12,15.31 27.96,17.14 v28.27,17.14 28.57,17.45 28.57,30.51 23.78,35.31 23.78,35.41 v21.43,37.76
GPA5  (via drill 0.35)
  Top 0.203: v19.59,15.92 16.12,15.92 15.41,15.21 10.92,15.21 IR2.3 | v26.12,12.14 26.74,12.14 27.14,11.74 OK2.13 28.27,12.65 29.7,12.65 IL6.A | v24.49,35.62 24.19,35.31 21.94,35.31 21.74,35.51 21.74,36.33 IC1.26
  Bottom 0.203: v19.59,15.92 22.35,15.92 25.26,13.01 | v26.12,12.14 25.26,13.01 | v24.49,35.62 24.49,35.21 28.98,30.72 28.98,16.74 25.26,13.01
GPA6  (via drill 0.35)
  Top 0.203: v12.25,14.29 10.92,14.29 IR2.2 | v26.23,9.7 26.64,9.7 27.14,9.18 OK2.11 27.25,9.08 29.7,9.08 IL7.A | v21.84,39.19 22.25,38.78 22.25,36.43 IC1.27
  Bottom 0.203: v26.23,9.7 17.04,9.7 14.49,12.25 14.29,12.25 v12.25,14.29 12.14,14.39 12.14,32.35 18.98,39.19 v21.84,39.19
GPA7  (via drill 0.35)
  Top 0.203: v12.55,11.84 10.92,13.47 IR2.1 | v26.12,6.74 27.04,6.74 27.14,6.63 OK2.9 27.25,6.53 28.47,5.31 29.7,5.31 IL8.A | v25.51,35.62 24.8,36.33 23.06,36.33 IC1.28
  Bottom 0.203: v12.55,11.84 14.29,11.84 19.39,6.74 v26.12,6.74 29.39,10 29.39,30.92 25.51,34.8 v25.51,35.62
GPB0
  Top 0.203: OR4.8 24.39,46.84 24.39,45 23.06,43.68 IC1.1
GPB1
  Top 0.203: OR4.7 23.57,46.84 23.57,45.62 22.35,44.39 22.35,43.68 IC1.2
GPB2
  Top 0.203: OR4.6 22.76,46.84 22.76,45.51 21.74,44.49 21.74,43.68 IC1.3
GPB3
  Top 0.203: OR4.5 22.04,46.84 22.04,45.41 21.12,44.49 21.12,43.68 IC1.4
GPB4
  Top 0.203: OR1.8 18.98,46.84 18.98,45.82 20.31,44.49 20.31,43.68 IC1.5
GPB5
  Top 0.203: OR1.7 18.16,46.84 18.16,45.92 19.7,44.39 19.7,43.68 IC1.6
GPB6
  Top 0.203: OR1.6 17.45,46.84 17.45,46.02 18.98,44.49 18.98,43.68 IC1.7
GPB7
  Top 0.203: OR1.5 16.63,46.84 16.63,46.23 18.37,44.49 18.37,43.68 IC1.8
IO5
  Top 0.203: 42.2,71.38 42.15,71.33 42.15,70.52 42.96,69.7 OK4.15 | 42.2,71.38 44.49,73.68 49.7,73.68 50.11,73.27 50.11,69.19 49.39,68.48 49.39,65.92 OR6.8 | 42.2,71.38 41.64,71.94 35.62,71.94 35,71.33 28.98,71.33 27.66,72.66 26.74,72.66 U1.4
IO6
  Top 0.203: 42.71,66.79 42.96,67.05 OK4.13 | 42.71,66.79 42.15,66.23 42.15,65.52 42.45,65.21 43.58,65.21 43.68,65.11 48.07,65.11 OR6.2 | 42.71,66.79 37.96,71.54 35.82,71.54 35.21,70.92 28.78,70.92 28.27,71.44 26.74,71.44 U1.3
IO7
  Top 0.203: OR6.3 48.07,64.39 43.17,64.39 43.06,64.5 OK4.11 42.96,64.7 42.35,64.7 41.74,65.31 41.74,65.72 37.15,70.31 35.92,70.31 35.82,70.21 26.74,70.21 U1.2
IO8
  Top 0.203: OR6.4 48.07,63.48 44.9,63.48 43.58,62.15 43.06,62.15 OK4.9 42.96,62.15 42.15,62.97 42.15,63.98 37.15,68.99 34.9,68.99 33.17,67.25 31.12,67.25 30.82,67.56 30.82,68.78 30.41,69.19 28.98,69.19 28.78,68.99 26.74,68.99 U1.1
LEDA
  Top 0.203: ER3.1 57.25,47.45 69.9,47.45 71.84,45.51 78.27,45.51 80.82,42.96 U$2.Y+
LEDB
  Top 0.203: ER4.1 57.25,45.31 57.96,45.31 58.68,46.02 64.5,46.02 80.82,29.7 U$2.G+
N$1
  Top 0.203: OD1.A 11.53,91.44 5,91.44 XO.1
N$2
  Top 0.203: PD1.C 65.82,4.29 65.82,8.47 PF1.1
N$3
  Top 0.203: MR3.1 10.31,39.59 11.33,39.59 14.49,36.43 IC1.15
N$4
  Top 0.203: OMF.2 21.33,90.52 16.94,90.52 16.02,91.44 OD1.C
N$5
  Top 0.203: R6.2 71.23,25.31 73.17,25.31 INDL.A
N$6
  Top 0.203: OF8.1 10,57.15 5,57.15 XO.10
N$7
  Top 0.203: D1.1 22.66,58.78 22.66,59.39 19.9,62.15 19.9,68.07 17.86,70.11 17.35,70.11 U1.17 17.96,70.11 18.68,70.82 18.68,71.84 18.47,72.05 16.12,72.05 15.1,71.03 13.27,71.03 11.74,69.5 11.74,63.68 12.86,62.56 12.86,61.03 OF7.2
N$8
  Top 0.203: OR1.4 16.63,48.17 16.63,50.31 24.8,58.48 24.8,80.52 29.39,85.11 36.23,85.11 OK3.1
N$9
  Top 0.203: ER3.2 55.31,47.45 55.31,46.74 53.98,45.41 53.98,42.45 54.29,42.15 55.11,42.15 ENC.27
N$10
  Top 0.203: 71.54,69.9 71.54,70.72 70.31,71.94 70.31,72.15 MC.8 | 71.54,69.9 71.63,69.83 | 71.54,69.9 72.33,69.11 Q1.3
N$11
  Top 0.203: PR1.1 71.23,21.23 73.17,21.23 PL.A
N$12
  Top 0.203: IR3.8 25.21,33.78 28.06,33.78 30.41,36.13 30.61,36.13 31.74,37.25 31.74,37.45 IL1.C
N$13
  Top 0.203: ENC.1 47.96,42.76 47.96,45.11 49.8,46.94 EC3.+
N$14  (via drill 0.35)
  Top 0.203: v55.31,43.58 55.31,45.21 ER4.2 | v53.78,41.64 54.09,41.64 54.29,41.43 55.11,41.43 ENC.26
  Bottom 0.203: v55.31,43.58 55.31,43.17 v53.78,41.64
N$15
  Top 0.203: MC.7 69.7,71.54 70.11,71.13 70.11,68.07 Q1.1
N$16  (via drill 0.35)
  Top 0.203: v51.64,10.61 51.02,10 50.01,10 PIC33.2 | v49.39,12.86 49.09,12.86 47.91,14.03 | 47.91,14.03 47.86,14.08 46.94,14.08 45.51,12.65 45.51,8.78 PCO.P$2 | PD2.C 51.23,23.68 51.23,22.14 47.96,18.88 47.96,14.08 47.91,14.03
  Bottom 0.203: v49.39,12.86 v51.64,10.61
N$17
  Top 0.203: ER1.1 49.6,31.02 45.82,34.8 45.82,35.62 47.05,36.84 47.86,36.84 ENC.10
N$18
  Top 0.203: IIR1.1 9.59,27.76 9.59,30.31 7.25,32.66 7.25,35.31 XI1.2
N$19
  Top 0.203: ER10.1 51.33,31.02 51.13,31.02 47.96,34.19 ENC.14
N$20
  Top 0.203: IR3.7 25.21,32.86 28.88,32.86 28.98,32.76 30.82,32.76 31.74,33.68 IL2.C
N$21
  Top 0.203: IR3.6 25.21,32.04 29.7,32.04 31.74,30 IL3.C
N$22
  Top 0.203: ENC.24 55.21,40.11 55.92,40.11 56.43,39.59 57.25,39.59 EC2.1 57.35,39.59 57.35,41.74 59.09,43.47 Q2.1
N$23
  Top 0.203: IR3.5 25.21,31.23 25.82,31.23 30.11,26.94 30.82,26.94 31.74,26.02 IL4.C
N$24
  Top 0.203: 57.2,38.12 56.23,39.09 56.23,39.19 56.02,39.39 55.21,39.39 ENC.23 | 57.2,38.12 57.25,38.06 57.25,37.04 EC1.1 | 57.2,38.12 57.25,38.17 59.29,38.17 60.72,39.59 60.72,41.33 62.86,43.47 Q2.2
N$25
  Top 0.203: IR4.8 27.04,21.53 31.74,16.84 31.74,16.53 IL5.C
N$26
  Top 0.203: IR4.7 26.23,21.53 26.23,18.16 31.74,12.65 IL6.C
N$27  (via drill 0.35)
  Top 0.203: v25.41,20.72 25.41,21.53 IR4.6 | v27.86,18.27 29.59,18.27 30.82,17.04 30.82,15.41 32.76,13.47 32.76,10 31.84,9.08 IL7.C
  Bottom 0.203: v27.86,18.27 v25.41,20.72
N$28
  Top 0.203: IIR1.2 9.59,26.94 9.29,26.94 7.25,28.98 7.25,31.43 5,33.68 XI1.3
N$29
  Top 0.203: IIR1.8 10.92,27.76 11.53,27.76 14.19,30.41 OK1.1
N$30
  Top 0.203: IIR1.7 10.92,26.94 13.27,26.94 14.19,27.86 OK1.3
N$31
  Top 0.203: IIR1.6 10.92,26.02 13.57,26.02 14.19,25.41 OK1.5
N$32
  Top 0.203: IIR1.5 10.92,25.21 11.84,25.21 14.19,22.86 OK1.7
N$33
  Top 0.203: IIR1.3 9.59,26.12 8.78,26.12 5,29.9 XI1.4
N$34
  Top 0.203: IIR1.4 9.59,25.31 5.82,25.31 XI1.5
N$35  (via drill 0.35)
  Top 0.203: v17.45,50.11 17.45,48.17 OR1.3 | v35.21,82.05 35.72,82.05 36.23,82.56 OK3.3
  Bottom 0.203: v17.45,50.11 17.45,66.03 26.12,74.7 26.12,79.5 28.68,82.05 v35.21,82.05
N$36
  Top 0.203: IIR2.1 9.59,10 9.59,11.94 5,16.53 XI2.2
N$37  (via drill 0.35)
  Top 0.203: v13.78,13.78 13.78,12.04 11.74,10 10.92,10 IIR2.8 | v17.35,17.35 20.82,17.35 21.23,16.94 21.23,15.92 20.82,15.51 OK2.1
  Bottom 0.203: v17.35,17.35 v13.78,13.78
N$38
  Top 0.203: IIR2.2 9.59,9.18 8.47,9.18 5,12.65 XI2.3
N$39
  Top 0.203: IIR2.7 10.92,9.18 17.04,9.18 20.72,12.86 OK2.3
N$40
  Top 0.203: IIR2.3 9.59,8.37 5.51,8.37 5,8.88 XI2.4
N$41
  Top 0.203: IIR2.6 10.92,8.37 14.39,8.37 14.8,8.78 19.18,8.78 20.72,10.31 OK2.5
N$42
  Top 0.203: IIR2.4 9.59,7.45 7.25,7.45 5,5.21 XI2.5
N$43
  Top 0.203: IIR2.5 10.92,7.55 14.19,7.55 14.7,8.06 20.51,8.06 20.72,7.86 OK2.7
N$44
  Top 0.203: IR4.5 24.59,21.53 24.59,9.29 26.74,7.14 29.9,7.14 31.74,5.31 IL8.C
N$45  (via drill 0.35)
  Top 0.203: v27.35,67.56 27.35,60.41 18.16,51.23 18.16,48.17 OR1.2 | v37.35,80.11 36.33,80.11 OK3.5
  Bottom 0.203: v27.35,67.56 27.35,78.68 28.78,80.11 v37.35,80.11
N$46  (via drill 0.35)
  Top 0.203: v18.98,51.02 18.98,48.17 OR1.1 | v35.1,77.46 36.13,77.46 36.23,77.56 OK3.7
  Bottom 0.203: v18.98,51.02 18.98,57.45 35.1,73.58 v35.1,77.46
N$47
  Top 0.203: 19.95,58.63 18.88,57.56 13.27,57.56 12.96,57.25 OF8.2 | 19.95,58.63 20,58.68 20.72,58.68 D1.2 | 19.95,58.63 19.49,59.09 19.49,62.15 17.66,63.98 17.66,68.07 17.35,68.37 17.35,68.88 U1.18
N$48
  Top 0.203: OR3.1 48.07,83.99 44.49,83.99 43.37,85.11 42.76,85.11 OK3.16
N$49
  Top 0.203: D2.2 16.74,58.78 16.74,60.92 12.96,64.7 OF6.2 12.96,64.8 14.08,65.92 14.08,68.68 16.84,71.44 17.25,71.44 U1.16
N$50  (via drill 0.35)
  Top 0.203: v14.29,64.6 18.68,60.21 18.68,58.78 D2.1 | v13.37,66.94 13.37,68.07 12.96,68.48 OF5.2 | v15.72,72.66 17.25,72.66 U1.15
  Bottom 0.203: v14.29,64.6 14.29,66.03 v13.37,66.94 13.47,66.94 15.72,69.19 v15.72,72.66
N$51
  Top 0.203: OF7.1 10,60.92 5,60.92 XO.9
N$52
  Top 0.203: OF6.1 10,64.8 5,64.8 XO.8
N$53
  Top 0.203: OR3.2 48.07,83.07 43.78,83.07 43.37,82.66 42.76,82.66 OK3.14
N$54
  Top 0.203: OF5.1 10,68.48 5,68.48 XO.7
N$55
  Top 0.203: OF4.1 10,72.25 5,72.25 XO.6
N$56
  Top 0.203: OR3.3 48.07,82.25 44.8,82.25 42.76,80.21 OK3.12
N$57  (via drill 0.35)
  Top 0.203: v23.79,74.1 22.66,72.97 22.66,64.6 D3.1 | v19.08,73.99 17.86,75.21 17.35,75.21 U1.13 17.25,75.31 15.41,75.31 14.8,75.92 12.96,75.92 OF3.2
  Bottom 0.203: v23.79,74.1 23.67,73.99 v19.08,73.99
N$58
  Top 0.203: OR3.4 48.07,81.44 46.53,81.44 42.76,77.66 OK3.10
N$59  (via drill 0.35)
  Top 0.203: v16.74,67.97 16.74,64.6 D4.2 | U1.12 17.25,76.54 16.74,76.03 v15.72,76.03 12.96,78.78 12.96,79.7 OF2.2
  Bottom 0.203: v16.74,67.97 16.74,75.01 v15.72,76.03
N$60
  Top 0.203: OK3.2 36.23,83.89 31.94,83.89 31.84,83.78 OL1.A
N$61
  Top 0.203: OK3.4 36.23,81.33 33.17,81.33 31.84,80.01 OL2.A
N$62
  Top 0.203: OK3.6 36.23,78.78 34.49,78.78 32.04,76.33 31.84,76.33 OL3.A
N$63
  Top 0.203: OK3.8 36.23,76.23 35.82,76.23 31.84,72.25 OL4.A
N$64  (via drill 0.35)
  Top 0.203: v18.37,67.97 18.68,67.66 18.68,64.6 D4.1 | v18.88,75.92 18.88,76.74 17.86,77.76 17.35,77.76 U1.11 17.25,77.86 16.84,77.86 16.02,78.68 16.02,78.78 12.96,81.84 12.96,83.48 OF1.2
  Bottom 0.203: v18.37,67.97 18.37,75.42 v18.88,75.92
N$65
  Top 0.203: D3.2 20.72,64.6 20.72,67.86 19.08,69.5 19.08,72.76 17.86,73.99 17.35,73.99 U1.14 17.25,73.99 16.02,73.99 14.29,72.25 12.96,72.25 OF4.2
N$66
  Top 0.203: OF3.1 10,76.03 5.1,76.03 5,76.13 XO.5
N$67
  Top 0.203: OF2.1 10,79.8 5.1,79.8 5,79.91 XO.4
N$68
  Top 0.203: OF1.1 10,83.58 5.1,83.58 5,83.68 XO.3
N$69  (via drill 0.35)
  Top 0.203: v22.14,54.18 22.14,48.17 OR4.4 | v37.66,70.82 36.64,70.82 36.53,70.92 OK4.1
  Bottom 0.203: v22.14,54.18 22.27,54.06 23.54,54.06 37.66,68.17 v37.66,70.82
N$70  (via drill 0.35)
  Top 0.203: v23.62,55.66 22.86,54.9 22.86,48.17 OR4.3 | v32.76,66.54 33.06,66.54 34.9,68.37 36.43,68.37 OK4.3
  Bottom 0.203: v23.62,55.66 25.4,57.44 25.4,59.18 v32.76,66.54
N$71
  Top 0.203: OR4.2 23.68,48.17 23.68,52.56 30.82,59.7 30.82,60.92 35.72,65.82 36.43,65.82 OK4.5
N$72
  Top 0.203: OR4.1 24.49,48.17 25.41,48.17 37.35,60.11 37.35,62.45 36.53,63.27 OK4.7
N$73
  Top 0.203: OR5.1 48.07,71.84 43.88,71.84 43.06,71.03 OK4.16
N$74
  Top 0.203: OR5.2 48.07,71.03 45.62,71.03 43.06,68.48 OK4.14
N$75
  Top 0.203: OR5.3 48.07,70.31 47.45,70.31 43.06,65.92 OK4.12
N$76  (via drill 0.35)
  Top 0.203: v44.39,65.82 48.07,69.5 OR5.4 | v44.09,63.68 43.37,63.68 43.06,63.37 OK4.10
  Bottom 0.203: v44.39,65.82 44.39,63.98 v44.09,63.68
N$77
  Top 0.203: OK4.2 36.43,69.6 33.17,69.6 31.84,68.27 OL5.A
N$78
  Top 0.203: OK4.4 36.43,67.05 35,67.05 32.25,64.29 31.84,64.29 OL6.A
N$79
  Top 0.203: OK4.6 36.43,64.5 35.72,64.5 31.84,60.62 31.84,60.31 OL7.A
N$80
  Top 0.203: OK4.8 36.43,62.05 36.43,60.92 31.84,56.33 OL8.A
OI1  (via drill 0.35)
  Top 0.203: v48.07,78.78 48.07,77.97 OR2.1 | OK3.15 41.82,83.92 41.55,83.8 38.97,81.21 v38.97,80.86 38.93,80.82 35.31,80.82 33.57,79.09 30.21,79.09 28.98,77.86 26.74,77.86 U1.8
  Bottom 0.203: v48.07,78.78 46.76,78.78 44.68,80.86 v38.97,80.86
OI2  (via drill 0.35)
  Top 0.203: 41.84,85.01 41.84,84.91 42.25,84.5 43.37,84.5 43.58,84.29 43.58,83.48 43.37,83.27 42.15,83.27 41.84,82.97 41.84,82.25 42.66,81.44 OK3.13 | 41.84,85.01 41.84,85.52 42.15,85.82 48.58,85.82 51.02,83.38 51.02,81.23 50.62,80.82 49.09,80.82 47.35,79.09 47.35,77.66 47.86,77.15 48.07,77.15 OR2.2 | v28.57,82.76 25.31,79.5 25.31,77.46 26.12,76.64 26.64,76.64 U1.7 | v37.35,82.76 39.59,82.76 41.84,85.01
  Bottom 0.203: v37.35,82.76 v28.57,82.76
OI3
  Top 0.203: 41.89,78.02 42.66,78.78 OK3.11 | 41.89,78.02 41.84,77.97 41.84,77.25 42.15,76.95 43.37,76.95 43.98,76.33 48.07,76.33 OR2.3 | U1.6 26.74,75.31 27.25,75.31 28.78,76.84 28.78,77.05 30.41,78.68 33.78,78.68 34.59,79.5 36.94,79.5 38.37,78.07 41.84,78.07 41.89,78.02
OI4
  Top 0.203: OR2.4 48.07,75.62 43.37,75.62 42.76,76.23 OK3.9 42.66,76.33 42.15,76.33 41.53,76.95 35.62,76.95 32.66,73.99 26.74,73.99 U1.5
RAW_IV
  Top 0.254: 40.51,25.92 40.51,34.8 GPIO.1 | 40.51,25.92 36.64,22.04 PC1.+ | 53.37,14.08 63.58,14.08 64.6,13.06 64.6,12.14 66.23,10.51 68.78,10.51 70.72,8.57 PF1.2 | 53.37,14.08 52.96,14.08 50.62,11.74 50.01,11.74 PIC33.1 | 40.51,25.92 52.66,25.92 53.37,25.21 53.37,14.08
RD+
  Top 0.203: 67.45,34.39 68.88,34.39 U$2.RD+ | 67.45,34.39 65.31,34.39 63.37,32.45 61.13,32.45 ERN1.6 | 67.45,34.39 67.45,32.76 63.27,28.57 54.09,28.57 52.35,30.31 52.35,31.53 48.98,34.9 47.96,34.9 ENC.13
RD-  (via drill 0.35)
  Top 0.203: v62.05,31.53 61.13,31.53 ERN1.5 | v46.53,35.31 46.74,35.51 47.86,35.51 ENC.12
  Bottom 0.203: v62.05,31.53 59.39,31.53 58.07,30.21 57.45,30.21 57.05,30.61 57.05,31.23 57.1,31.28 | 57.1,31.28 63.98,38.17 66.33,38.17 U$2.RD- | v46.53,35.31 53.07,35.31 57.1,31.28
RESET  (via drill 0.35)
  Top 0.203: R2.1 55.92,82.05 58.07,82.05 C2.1 57.33,81.25 v57.33,80.52 | v62.97,73.07 62.97,70.62 62.56,70.21 62.56,70.01 MC.29 62.45,69.9 59.39,66.84 59.39,59.39 65.11,53.68 v65.11,53.27
  Bottom 0.203: v62.97,73.07 57.33,78.7 v57.33,80.52 57.33,86.72 62.97,92.36 66.44,92.36 67.15,91.64 67.15,91.13 68.48,89.8 68.48,88.78 BL.5 | v65.11,53.27 65.52,53.68 73.37,53.68 82.66,44.39 82.66,25.1 81.54,23.98 81.54,21.02 SR.1
RXI
  Top 0.203: MC.30 62.97,69.29 62.97,68.99 59.8,65.82 59.8,59.6 71.94,47.45 72.15,47.45 PP.4
TD+  (via drill 0.35)
  Top 0.203: v58.88,34.09 58.98,33.98 59.8,33.98 ERN1.1 | v57.1,34.85 56.44,35.51 55.21,35.51 ENC.17
  Bottom 0.203: U$2.TD+ 68.99,31.94 70.01,32.96 70.01,37.35 69.39,37.96 69.09,37.96 67.86,39.19 64.39,39.19 59.29,34.09 v58.88,34.09 57.87,34.09 v57.1,34.85
TD-
  Top 0.203: 57.71,32.09 56.94,31.33 55.82,31.33 55.62,31.53 55.62,33.37 56.23,33.98 56.23,34.59 55.92,34.9 55.21,34.9 ENC.16 | 57.71,32.09 58.68,33.06 59.8,33.06 ERN1.2 | 57.71,32.09 58.98,30.82 62.35,30.82 64.6,33.06 66.33,33.06 U$2.TD-
TXO
  Top 0.203: MC.31 63.58,68.78 63.58,68.48 60.21,65.11 60.21,59.8 70.01,50.01 72.15,50.01 PP.3
VDDO  (via drill 0.35)
  Top 0.254: D2.3 21.74,56.74 D1.3 21.84,56.84 22.25,56.84 23.47,58.07 23.47,60.41 21.64,62.25 D3.3 | v18.78,61.84 18.16,62.45 17.76,62.45 D4.3 | v20.72,62.35 21.64,62.35 21.74,62.45 D3.3 | 20.26,76.69 20.41,76.54 20.41,68.88 21.64,67.66 21.64,62.56 D3.3 | 20.26,76.69 17.96,78.99 17.35,78.99 U1.10 | OR5.5 49.39,69.6 49.39,70.31 OR5.6 49.39,70.42 49.39,71.03 OR5.7 49.39,71.23 49.39,71.84 OR5.8 49.39,72.05 v49.39,72.97 | OR3.8 49.39,83.89 49.39,83.17 OR3.7 49.39,83.07 49.39,82.35 OR3.6 49.39,82.25 49.39,81.54 OR3.5 49.49,81.54 v50.31,81.54 | OMF.1 24.19,90.52 28.98,90.52 OD2.C 29.08,90.62 30.51,92.05 39.7,92.05 40.92,90.83 41.64,90.83 EC6.+ | v42.45,89.5 42.45,89.8 41.64,90.62 EC6.+ | 20.26,76.69 30.72,87.15 37.35,87.15 40.92,90.72 EC6.+
  Bottom 0.254: v18.78,61.84 20.21,61.84 v20.72,62.35 | v49.39,72.97 49.39,80.62 v50.31,81.54 50.31,81.64 v42.45,89.5
VIN  (via drill 0.35)
  Top 0.203: PJ1.VIN0 81.95,4.39 80.52,5.82 74.29,5.82 72.76,4.29 70.21,4.29 PD1.A 70.21,4.39 69.9,4.69 v69.9,5.61
  Bottom 0.203: v69.9,5.61 69.9,21.94 68.78,23.06 63.98,23.06 53.27,33.78 47.05,33.78 44.8,36.02 37.86,36.02 33.98,39.9 16.84,39.9 9.49,47.25 5,47.25 XV.2
WFGPIO0
  Bottom 0.203: WIFI.GPIO0 67.25,64.29 67.25,63.27 65.72,61.74 65.72,61.43 54.49,50.21 40.62,50.21 GPIO.13
WFGPIO2
  Bottom 0.203: WIFI.GPIO2 64.7,64.29 63.88,64.29 62.45,62.86 55.41,62.86 43.78,51.23 39.09,51.23 38.06,50.21 GPIO.14

## Text on the board
tPlace: ON | Edge | IOTECH © 2019 | IOTB v2.5 TOP | www.iotech.com.tr | S/N:
bPlace: IOTB BOT | IOTECH
bNames: C:/Users/celikada/Downloads/5.bmp